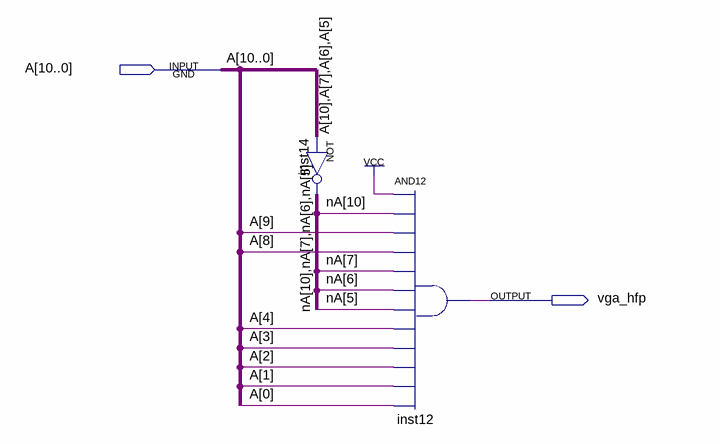
[diagram p0: schematic sheet]
// Quartus schematic vga_hfp.bdf as structural Verilog: 2 symbols, 2 pins
module vga_hfp (
  input  [10:0] A,
  output vga_hfp
);

  wire [10:5] nA;

  assign {nA[10], nA[7:5]} = ~{A[10], A[7:5]};  // NOT inst14, 4 bits wide
  and inst12 (vga_hfp, 1'b1, nA[10], A[9], A[8], nA[7], nA[6], nA[5], A[4], A[3], A[2], A[1], A[0]);
endmodule
